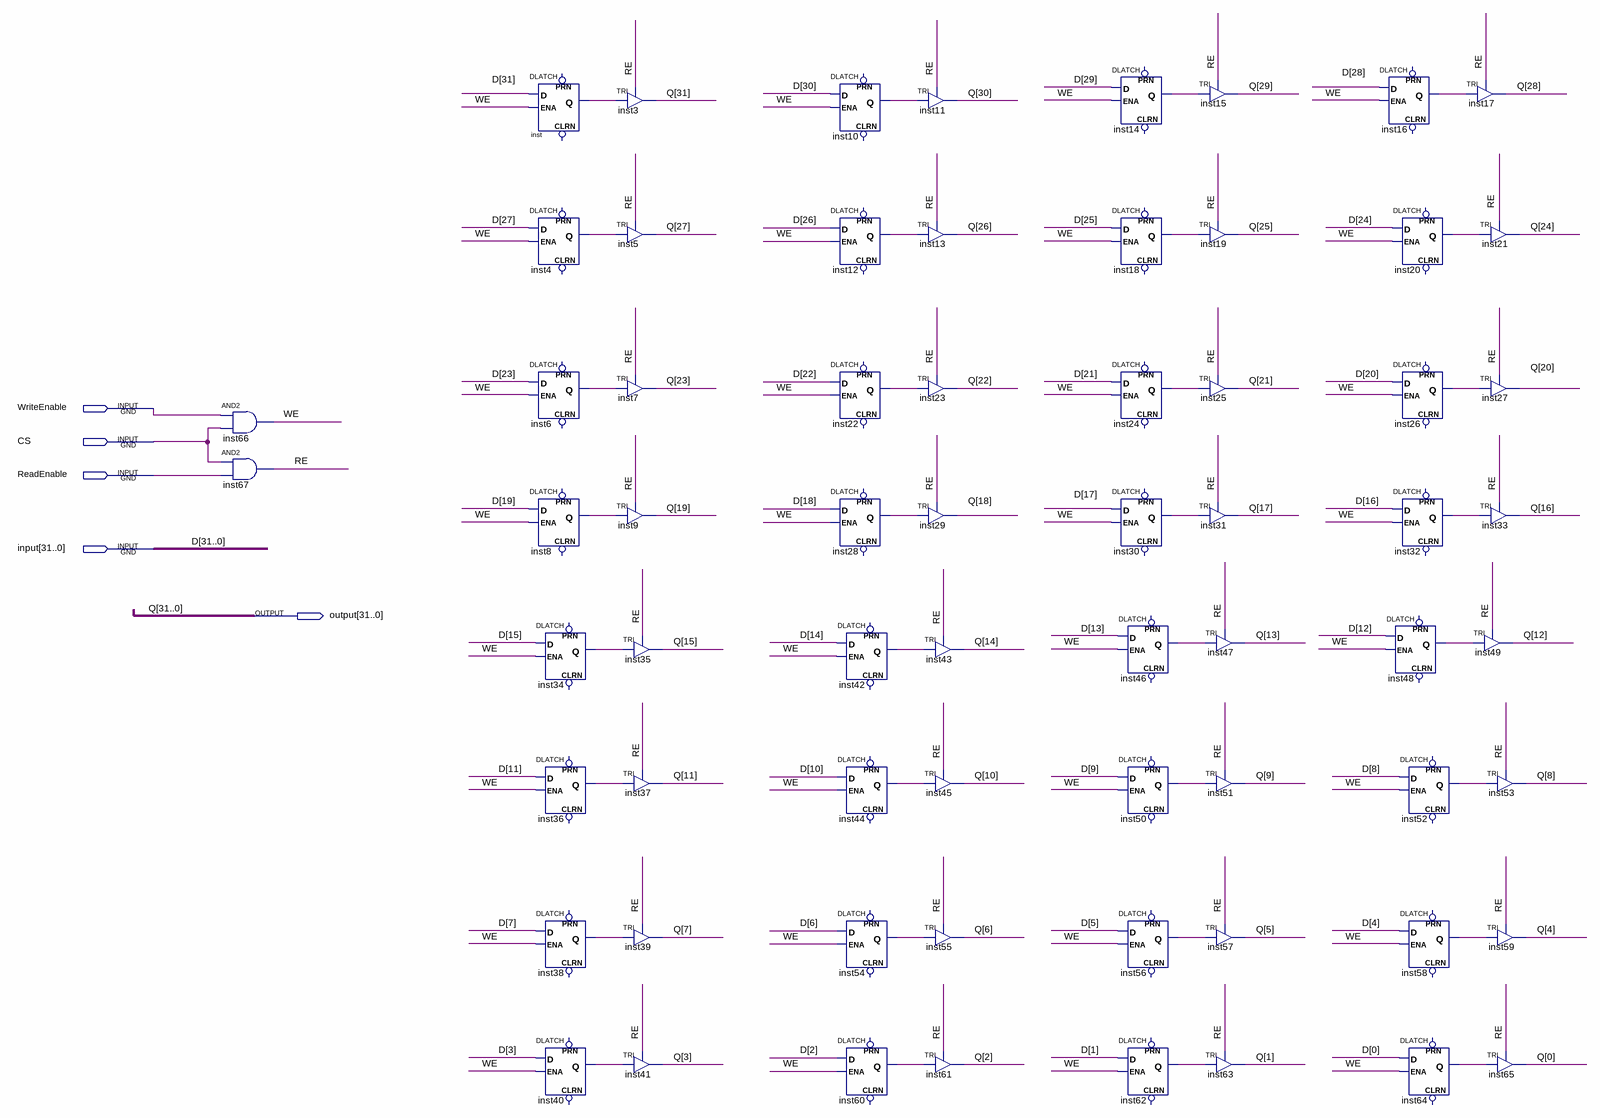
[diagram p0: schematic sheet]
// Quartus schematic Ramcell32.bdf as structural Verilog: 66 symbols, 5 pins
module Ramcell32 (
  input  WriteEnable,
  input  CS,
  input  ReadEnable,
  input  [31:0] \input ,
  output [31:0] \output 
);

  wire inst4_q, inst6_q, inst8_q, inst10_q, inst12_q, inst14_q, inst16_q, inst18_q, inst20_q, inst22_q,
       inst24_q, inst26_q, inst28_q, inst30_q, inst32_q, inst34_q, inst36_q, inst38_q, inst40_q, inst42_q,
       inst44_q, inst46_q, inst48_q, inst50_q, inst52_q, inst54_q, inst56_q, inst58_q, inst60_q, inst62_q,
       inst64_q, inst_q, RE, WE;

  and inst66 (WE, WriteEnable, CS);
  and inst67 (RE, CS, ReadEnable);
  DLATCH inst (.D(\input [31]), .ENA(WE), .Q(inst_q));  // open: CLRN, PRN
  DLATCH inst4 (.D(\input [27]), .ENA(WE), .Q(inst4_q));  // open: CLRN, PRN
  DLATCH inst6 (.D(\input [23]), .ENA(WE), .Q(inst6_q));  // open: CLRN, PRN
  DLATCH inst8 (.D(\input [19]), .ENA(WE), .Q(inst8_q));  // open: CLRN, PRN
  DLATCH inst34 (.D(\input [15]), .ENA(WE), .Q(inst34_q));  // open: CLRN, PRN
  DLATCH inst36 (.D(\input [11]), .ENA(WE), .Q(inst36_q));  // open: CLRN, PRN
  DLATCH inst38 (.D(\input [7]), .ENA(WE), .Q(inst38_q));  // open: CLRN, PRN
  DLATCH inst40 (.D(\input [3]), .ENA(WE), .Q(inst40_q));  // open: CLRN, PRN
  TRI inst3 (.IN(inst_q), .OE(RE), .OUT(\output [31]));
  TRI inst5 (.IN(inst4_q), .OE(RE), .OUT(\output [27]));
  TRI inst7 (.IN(inst6_q), .OE(RE), .OUT(\output [23]));
  TRI inst9 (.IN(inst8_q), .OE(RE), .OUT(\output [19]));
  TRI inst35 (.IN(inst34_q), .OE(RE), .OUT(\output [15]));
  TRI inst37 (.IN(inst36_q), .OE(RE), .OUT(\output [11]));
  TRI inst39 (.IN(inst38_q), .OE(RE), .OUT(\output [7]));
  TRI inst41 (.IN(inst40_q), .OE(RE), .OUT(\output [3]));
  DLATCH inst10 (.D(\input [30]), .ENA(WE), .Q(inst10_q));  // open: CLRN, PRN
  DLATCH inst12 (.D(\input [26]), .ENA(WE), .Q(inst12_q));  // open: CLRN, PRN
  DLATCH inst22 (.D(\input [22]), .ENA(WE), .Q(inst22_q));  // open: CLRN, PRN
  DLATCH inst28 (.D(\input [18]), .ENA(WE), .Q(inst28_q));  // open: CLRN, PRN
  DLATCH inst42 (.D(\input [14]), .ENA(WE), .Q(inst42_q));  // open: CLRN, PRN
  DLATCH inst44 (.D(\input [10]), .ENA(WE), .Q(inst44_q));  // open: CLRN, PRN
  DLATCH inst54 (.D(\input [6]), .ENA(WE), .Q(inst54_q));  // open: CLRN, PRN
  DLATCH inst60 (.D(\input [2]), .ENA(WE), .Q(inst60_q));  // open: CLRN, PRN
  TRI inst11 (.IN(inst10_q), .OE(RE), .OUT(\output [30]));
  TRI inst13 (.IN(inst12_q), .OE(RE), .OUT(\output [26]));
  TRI inst23 (.IN(inst22_q), .OE(RE), .OUT(\output [22]));
  TRI inst29 (.IN(inst28_q), .OE(RE), .OUT(\output [18]));
  TRI inst43 (.IN(inst42_q), .OE(RE), .OUT(\output [14]));
  TRI inst45 (.IN(inst44_q), .OE(RE), .OUT(\output [10]));
  TRI inst55 (.IN(inst54_q), .OE(RE), .OUT(\output [6]));
  TRI inst61 (.IN(inst60_q), .OE(RE), .OUT(\output [2]));
  DLATCH inst14 (.D(\input [29]), .ENA(WE), .Q(inst14_q));  // open: CLRN, PRN
  DLATCH inst18 (.D(\input [25]), .ENA(WE), .Q(inst18_q));  // open: CLRN, PRN
  DLATCH inst24 (.D(\input [21]), .ENA(WE), .Q(inst24_q));  // open: CLRN, PRN
  DLATCH inst30 (.D(\input [17]), .ENA(WE), .Q(inst30_q));  // open: CLRN, PRN
  DLATCH inst46 (.D(\input [13]), .ENA(WE), .Q(inst46_q));  // open: CLRN, PRN
  DLATCH inst50 (.D(\input [9]), .ENA(WE), .Q(inst50_q));  // open: CLRN, PRN
  DLATCH inst56 (.D(\input [5]), .ENA(WE), .Q(inst56_q));  // open: CLRN, PRN
  DLATCH inst62 (.D(\input [1]), .ENA(WE), .Q(inst62_q));  // open: CLRN, PRN
  TRI inst15 (.IN(inst14_q), .OE(RE), .OUT(\output [29]));
  TRI inst19 (.IN(inst18_q), .OE(RE), .OUT(\output [25]));
  TRI inst25 (.IN(inst24_q), .OE(RE), .OUT(\output [21]));
  TRI inst31 (.IN(inst30_q), .OE(RE), .OUT(\output [17]));
  TRI inst47 (.IN(inst46_q), .OE(RE), .OUT(\output [13]));
  TRI inst51 (.IN(inst50_q), .OE(RE), .OUT(\output [9]));
  TRI inst57 (.IN(inst56_q), .OE(RE), .OUT(\output [5]));
  TRI inst63 (.IN(inst62_q), .OE(RE), .OUT(\output [1]));
  DLATCH inst16 (.D(\input [28]), .ENA(WE), .Q(inst16_q));  // open: CLRN, PRN
  DLATCH inst20 (.D(\input [24]), .ENA(WE), .Q(inst20_q));  // open: CLRN, PRN
  DLATCH inst26 (.D(\input [20]), .ENA(WE), .Q(inst26_q));  // open: CLRN, PRN
  DLATCH inst32 (.D(\input [16]), .ENA(WE), .Q(inst32_q));  // open: CLRN, PRN
  DLATCH inst48 (.D(\input [12]), .ENA(WE), .Q(inst48_q));  // open: CLRN, PRN
  DLATCH inst52 (.D(\input [8]), .ENA(WE), .Q(inst52_q));  // open: CLRN, PRN
  DLATCH inst58 (.D(\input [4]), .ENA(WE), .Q(inst58_q));  // open: CLRN, PRN
  DLATCH inst64 (.D(\input [0]), .ENA(WE), .Q(inst64_q));  // open: CLRN, PRN
  TRI inst17 (.IN(inst16_q), .OE(RE), .OUT(\output [28]));
  TRI inst21 (.IN(inst20_q), .OE(RE), .OUT(\output [24]));
  TRI inst27 (.IN(inst26_q), .OE(RE), .OUT(\output [20]));
  TRI inst33 (.IN(inst32_q), .OE(RE), .OUT(\output [16]));
  TRI inst49 (.IN(inst48_q), .OE(RE), .OUT(\output [12]));
  TRI inst53 (.IN(inst52_q), .OE(RE), .OUT(\output [8]));
  TRI inst59 (.IN(inst58_q), .OE(RE), .OUT(\output [4]));
  TRI inst65 (.IN(inst64_q), .OE(RE), .OUT(\output [0]));

  // Other names for the same wires on the sheet: D[31:0] = \input ; Q[31:0] = \output 
endmodule
